# EAGLE design Halfshield (EAGLE 7.0.0)
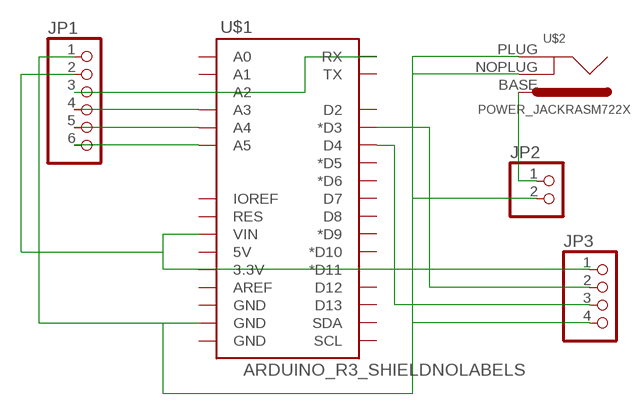
[diagram p0: schematic, sheet 1]

## Parts
JP1  PINHD-1X6  [1X06]
JP2  PINHD-1X2  [1X02]
JP3  PINHD-1X4  [1X04]
U$1  ARDUINO_R3_SHIELDNOLABELS  [UNO_R3_SHIELD_NOLABELS]
U$2  POWER_JACKRASM722X  [RASM722X]

## Nets
N$1: JP1.6 U$1.A5
N$2: JP1.5 U$1.A4
N$3: JP1.4 U$1.A3
N$4: JP1.3 U$1.RX
N$5: JP1.2 JP3.1 U$1.VIN
N$6: JP2.1 U$2.BASE(GND)
N$7: JP1.1 JP2.2 JP3.4 U$1.GND@1(GND) U$2.NOPLUG(OFF) U$2.PLUG(ON)
N$8: JP3.3 U$1.D4
N$9: JP3.2 U$1.D3(*D3)
Unconnected: U$1.3.3V U$1.5V U$1.A0 U$1.A1 U$1.A2 U$1.AREF U$1.D2 U$1.D5(*D5) U$1.D6(*D6) U$1.D7 U$1.D8 U$1.D9(*D9) U$1.D10(*D10) U$1.D11(*D11) U$1.D12 U$1.D13 U$1.GND@0(GND) U$1.GND@2(GND) U$1.IOREF U$1.RES U$1.SCL U$1.SDA U$1.TX

## Library data of the parts
JP1 = pinhead:PINHD-1X6: PIN HEADER
JP2 = pinhead:PINHD-1X2: PIN HEADER
JP3 = pinhead:PINHD-1X4: PIN HEADER
U$1 = SparkFun-Boards:ARDUINO_R3_SHIELD: Shield form compatible with the Arduino Uno R3.
U$2 = thar:POWER_JACK: Power Plug

## Board
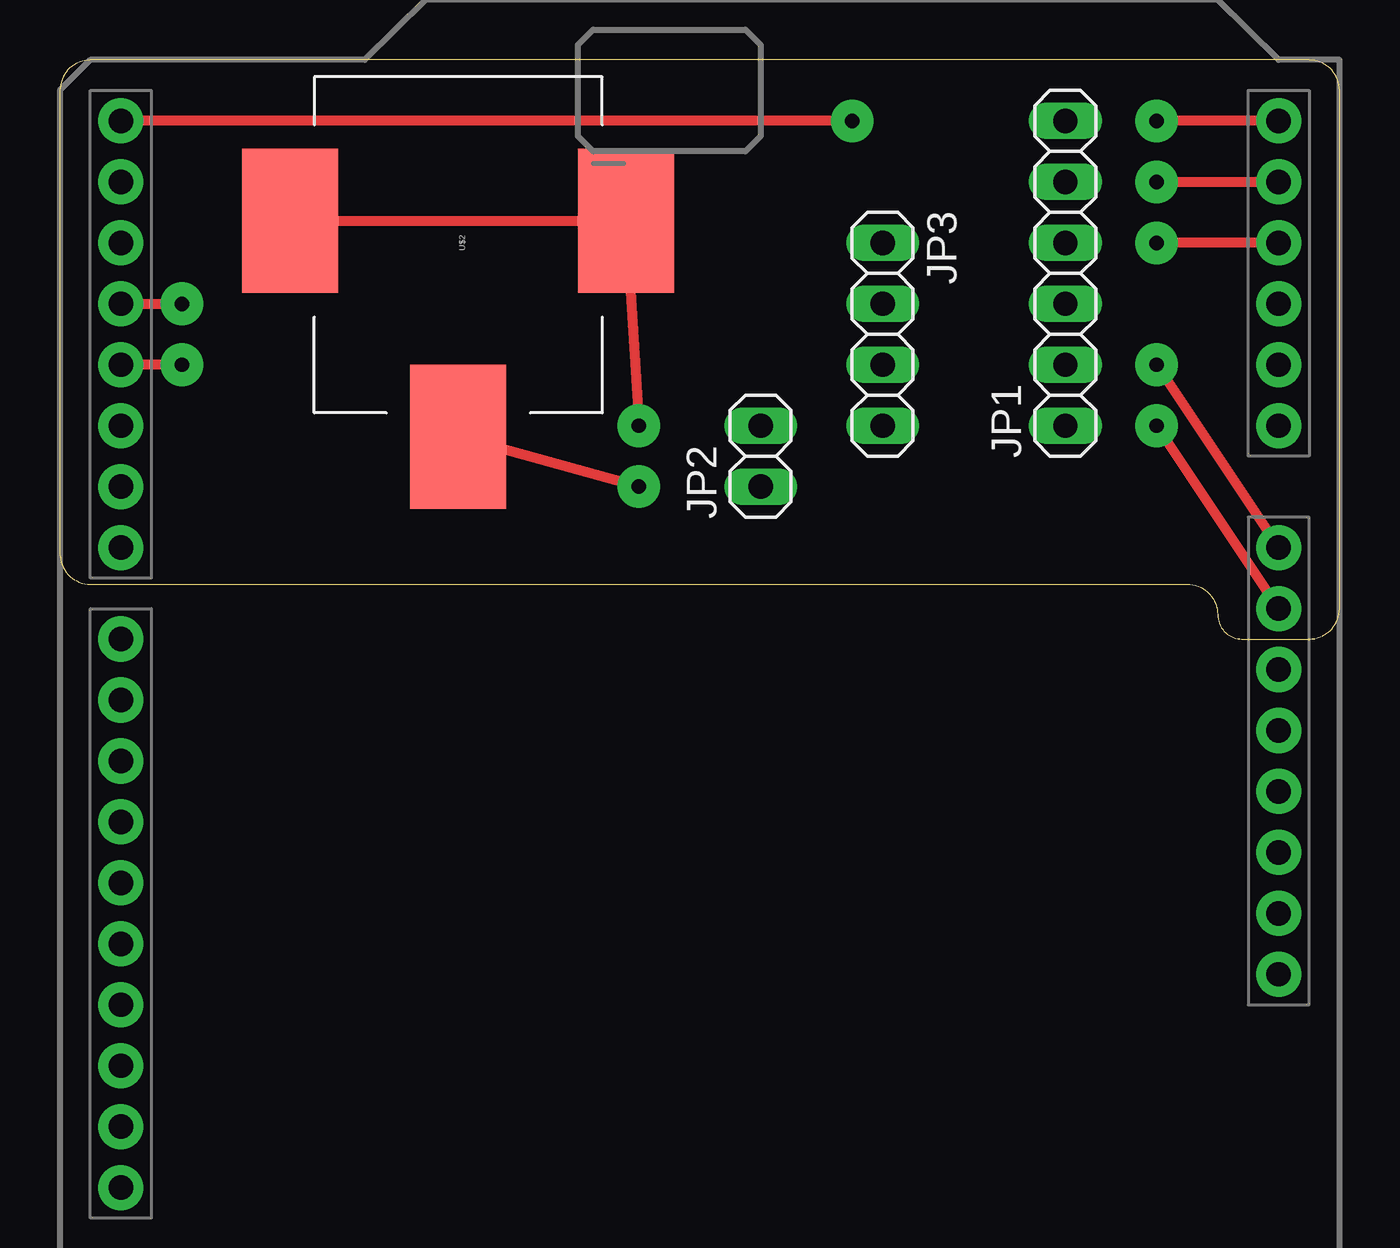
[diagram p1: board, top side]
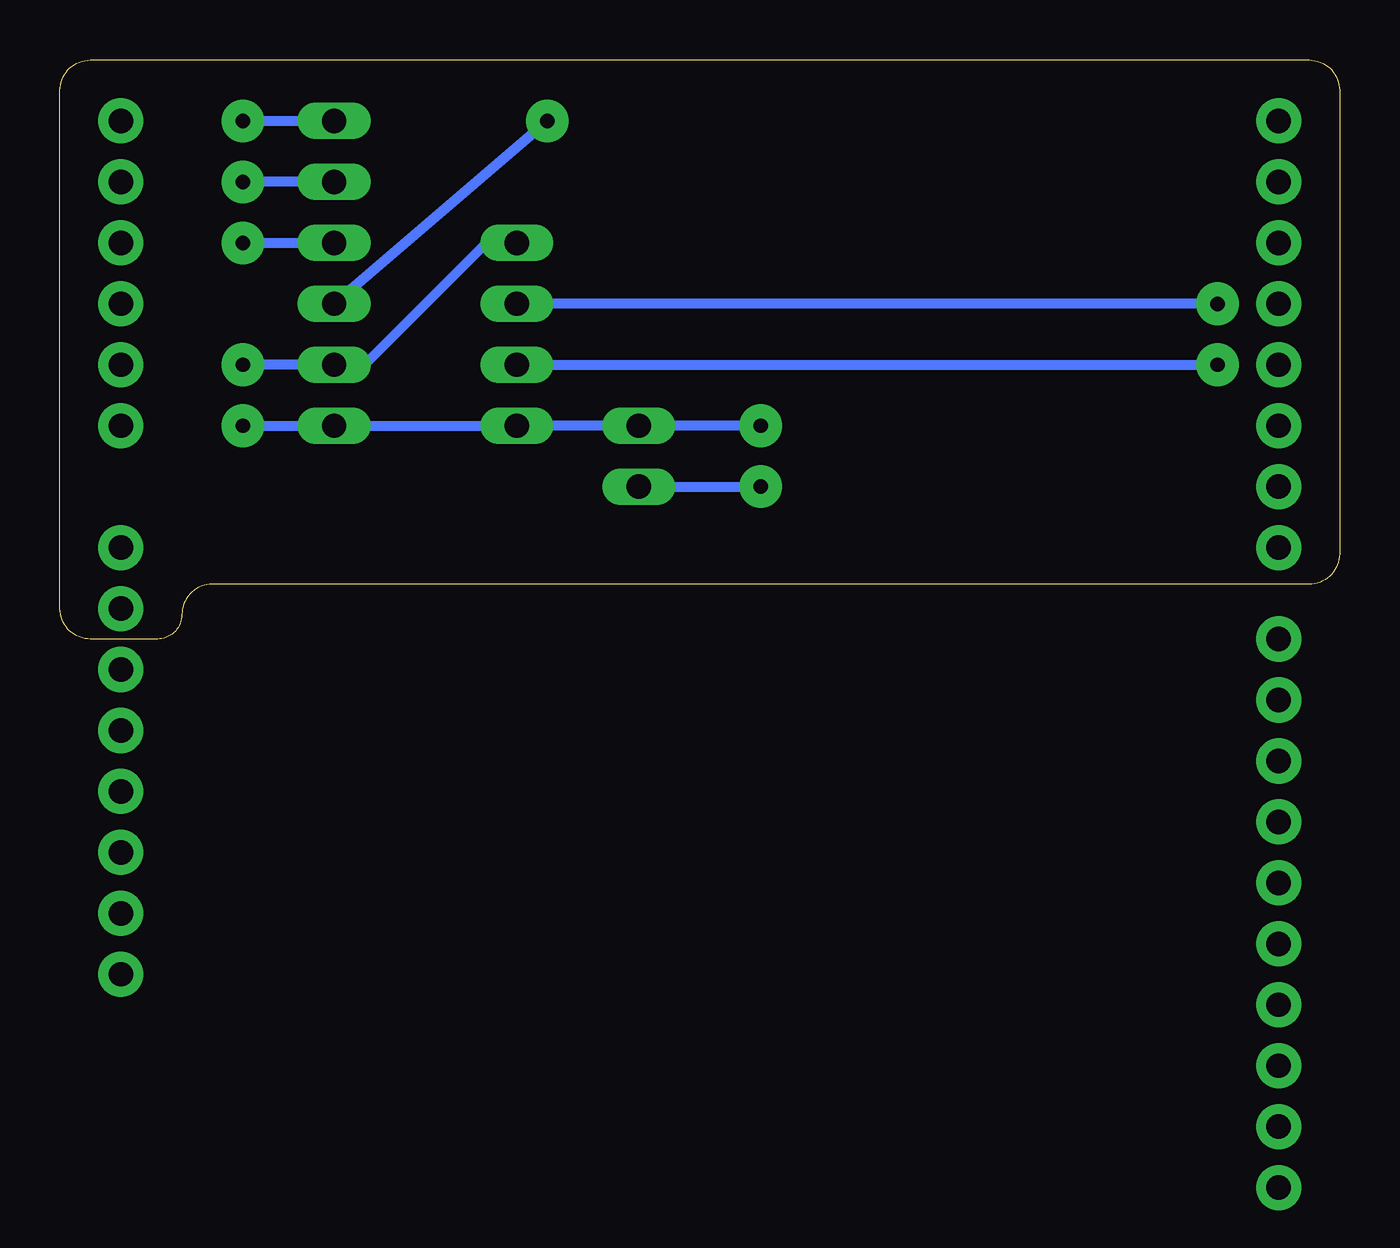
[diagram p2: board, bottom side, seen from below]

Size 53.34 x 24.13 mm. Coordinates in mm from the lower left corner, seen from the top.
Outline: 0,22.86 0,3.56 arc90 1.27,2.29 46.99,2.29 arc-90 48.26,1.02 arc90 49.28,0 52.07,0 arc90 53.34,1.27 53.34,22.86 arc90 52.07,24.13 1.27,24.13 arc90 0,22.86
Copper layers (1*16): Top 0.035mm / dielectric 1.5mm / Bottom 0.035mm
Design rules "default": minimum track width 10mil, minimum drill 24mil, track to track 8mil, track to pad 8mil, pad to pad 8mil, via to via 8mil, smd to smd 8mil, copper to edge 40mil, drill to drill 8mil, minimum pad ring 10mil, minimum via ring 8mil, stop-mask expansion 4mil, vias tented up to drill 0mil, thermal gap 10mil

### Footprints (pad centres in the part's own frame; a part is rotated, then mirrored left to right if it is on the bottom)
1X06 = drill 1.016 long: 1 -6.35,0; 2 -3.81,0; 3 -1.27,0; 4 1.27,0; 5 3.81,0; 6 6.35,0
1X02 = drill 1.016 long: 1 -1.27,0; 2 1.27,0
1X04 = drill 1.016 long: 1 -3.81,0; 2 -1.27,0; 3 1.27,0; 4 3.81,0
UNO_R3_SHIELD_NOLABELS = drill 1.016 pad 1.88: 3.3V 50.8,26.67; 5V 50.8,29.21; A0 50.8,41.91; A1 50.8,44.45; A2 50.8,46.99; A3 50.8,49.53; A4 50.8,52.07; A5 50.8,54.61; AREF 2.54,15.24; D2 2.54,49.53; D3 2.54,46.99; D4 2.54,44.45; D5 2.54,41.91; D6 2.54,39.37; D7 2.54,36.83; D8 2.54,33.02; D9 2.54,30.48; D10 2.54,27.94; D11 2.54,25.4; D12 2.54,22.86; D13 2.54,20.32; GND@0 50.8,31.75; GND@1 50.8,34.29; GND@2 2.54,17.78; IOREF 50.8,21.59; NC 50.8,19.05; RES 50.8,24.13; RX 2.54,54.61; SCL 2.54,10.16; SDA 2.54,12.7; TX 2.54,52.07; VIN 50.8,36.83
RASM722X = smd 6 x 4: BASE 8.08,0.095; NOPLUG -0.92,-6.905; PLUG -0.92,7.095

### Placement (x,y rotation side)
JP1  41.91,15.24 90 top
JP2  29.21,7.62 90 top
JP3  34.29,12.7 270 top
U$1  0,-33.02 0 top
U$2  16.51,16.51 270 top

### Tracks (layer width: path | path; a pad name or v marks a point on that pad's centre or on a via)
N$1  (via drill 0.6 pad 1.78)
  Top 0.406: U$1.A5 v45.72,21.59
  Bottom 0.406: v45.72,21.59 JP1.6
N$2  (via drill 0.6 pad 1.78)
  Top 0.406: v45.72,19.05 U$1.A4
  Bottom 0.406: JP1.5 v45.72,19.05
N$3  (via drill 0.6 pad 1.78)
  Top 0.406: U$1.A3 v45.72,16.51
  Bottom 0.406: v45.72,16.51 JP1.4
N$4  (via drill 0.6 pad 1.78)
  Top 0.406: v33.02,21.59 U$1.RX
  Bottom 0.406: JP1.3 v33.02,21.59
N$5  (via drill 0.6 pad 1.78)
  Top 0.406: v45.72,11.43 U$1.VIN
  Bottom 0.406: v45.72,11.43 JP1.2 40.64,11.43 35.56,16.51 JP3.1
N$6  (via drill 0.6 pad 1.78)
  Top 0.406: v24.13,6.35 U$2.BASE
  Bottom 0.406: JP2.1 v24.13,6.35
N$7  (via drill 0.6 pad 1.78)
  Top 0.406: U$1.GND@1 v45.72,8.89 | U$2.NOPLUG U$2.PLUG v24.13,8.89
  Bottom 0.406: v45.72,8.89 JP1.1 JP3.4 JP2.2 v24.13,8.89
N$8  (via drill 0.6 pad 1.78)
  Top 0.406: v5.08,11.43 U$1.D4
  Bottom 0.406: JP3.3 v5.08,11.43
N$9  (via drill 0.6 pad 1.78)
  Top 0.406: U$1.D3 v5.08,13.97
  Bottom 0.406: v5.08,13.97 JP3.2